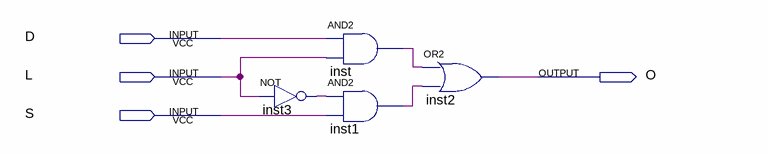
[diagram p0: schematic sheet]
// Quartus schematic LOAD_SHIFT.bdf as structural Verilog: 4 symbols, 4 pins
module LOAD_SHIFT (
  input  D,
  input  L,
  input  S,
  output O
);

  wire inst1_out, inst3_out, inst_out;

  not inst3 (inst3_out, L);
  and inst (inst_out, D, L);
  and inst1 (inst1_out, inst3_out, S);
  or inst2 (O, inst_out, inst1_out);
endmodule
